# Altium project Archim2.PrjPcb (part 3 of 3)

## Sheet USB.SchDoc: USB
size Letter; DocumentNumber: 2; SheetNumber: 3; SheetTotal: 11
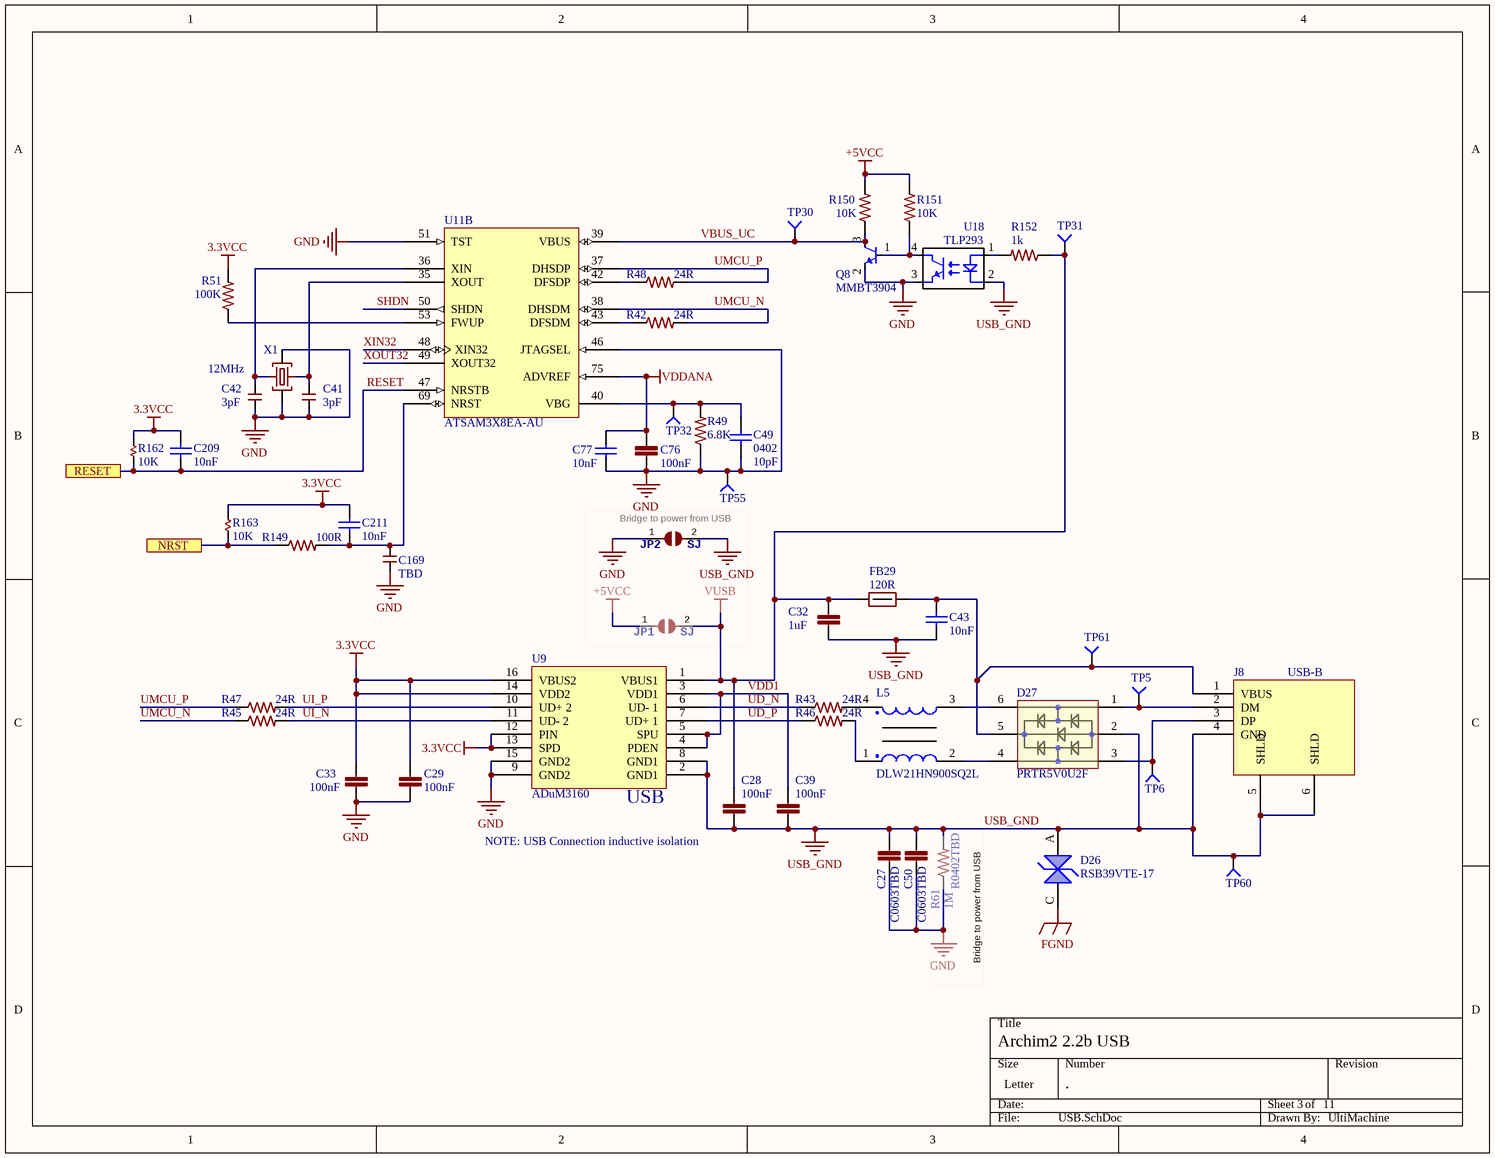
[diagram p10: USB.SchDoc]

### Parts
(Parts that share a designator on the sheet are numbered #1, #2 ... from top to bottom, then left to right.)
C27  C0603TBD  [C0603]
C28  100nF  [C0402]
C29  100nF  [C0402]
C32  1uF  [C0402]
C33  100nF  [C0402]
C39  100nF  [C0402]
C41  3pF  [C0603]
C42  3pF  [C0603]
C43  10nF  [C0402]
C49  0402  value 10pF  [C0402]
C50  C0603TBD  [C0603]
C76  100nF  [C0402]
C77  10nF  [C0402]
C169  TBD  [C0402]
C209  10nF  [C0402]
C211  10nF  [C0402]
D26  RSB39VTE-17  [SOD323-R]
D27  PRTR5V0U2F  [SOT886]
FB29  120R  [FB0603]
J8  USB-B  [PN61729]
JP1  SJ  [SJ]  (no BOM)
JP2  SJ  [SJ]  (no BOM)
L5  DLW21HN900SQ2L  [DLW21HN900SQ2L]
Q8  MMBT3904  [SOT523 SMALL]
R42  24R  [R0402]
R43  24R  [R0402]
R45  24R  [R0402]
R46  24R  [R0402]
R47  24R  [R0402]
R48  24R  [R0402]
R49  6.8K  [R0402]
R51  100K  [R0402]
R61  R0402TBD  value 1M  [R0402TBD]
R149  100R  [R0402]
R150  10K  [R0402]
R151  10K  [R0402]
R152  1k  [R0402]
R162  10K  [R0402]
R163  10K  [R0402]
TP5  TP4  [TP-2]  (value not drawn)  (no BOM)
TP6  TP4  [TP-2]  (value not drawn)  (no BOM)
TP30  TP4  [TP-2]  (value not drawn)  (no BOM)
TP31  TP4  [TP-2]  (value not drawn)  (no BOM)
TP32  TP4  [TP-2]  (value not drawn)  (no BOM)
TP55  TP4  [TP-2]  (value not drawn)  (no BOM)
TP60  TP4  [TP-2]  (value not drawn)  (no BOM)
TP61  TP4  [TP-2]  (value not drawn)  (no BOM)
U9  ADuM3160  [ADuM4160]
U11#2  ATSAM3X8EA-AU  [LQFP144_N]  (part B of 3)
U18  TLP293  [SO-4]
X1  12MHz  [CRYS320500]

### Blocks framed on the sheet
Bridge to power from USB: JP1 JP2

### Ports
NRST, RESET

### Nets
3.3VCC: C29.1 C33.1 C209.1 C211.1 R51.2 R162.2 R163.2 U9.12(PIN) U9.13(SPD) U9.14(VDD2) U9.16(VBUS2)
+5VCC: JP1.1 R150.2 R151.2
FGND: D26.C
GND: C27.2 C29.2 C33.2 C41.1 C42.1 C49.2 C50.2 C76.2 C77.2 C169.2 JP2.1 Q8.2(E) R49.1 R61.1 TP55.1 U9.9(GND2) U9.15(GND2) U11#2.46(JTAGSEL) U11#2.51(TST) U18.3(E) X1.2(GND) X1.4(GND)
USB_GND: C27.1 C28.2 C32.2 C39.2 C43.1 C50.1 D26.A D27.2 J8.4(GND) J8.5(SHLD) J8.6(SHLD) JP2.2 R61.2 TP60.1 U9.2(GND1) U9.8(GND1) U18.2(K)
VDDANA: C76.1 C77.1 U11#2.75(ADVREF)
VUSB: C28.1 C32.1 FB29.1 JP1.2 R152.1 TP31.1 U9.1(VBUS1)
NRST: R149.1 R163.1 ; port NRST
RESET: C209.2 R162.1 U11#2.47(NRSTB) ; port RESET
SHDN: U11#2.50(SHDN)
UD_N: R43.1 U9.6(UD-_1)
UD_P: R46.1 U9.7(UD+_1)
UI_N: R45.2 U9.11(UD-_2)
UI_P: R47.2 U9.10(UD+_2)
UMCU_N: R42.2 R45.1 U11#2.38(DHSDM)
UMCU_P: R47.1 R48.2 U11#2.37(DHSDP)
VBUS_UC: Q8.3(C) R150.1 TP30.1 U11#2.39(VBUS)
VDD1: C39.1 U9.3(VDD1) U9.4(PDEN) U9.5(SPU)
XIN32: U11#2.48(XIN32)
XOUT32: U11#2.49(XOUT32)
NetC41_2: C41.2 U11#2.35(XOUT) X1.3(C2)
NetC42_2: C42.2 U11#2.36(XIN) X1.1(C1)
NetC43_2: C43.2 D27.5 FB29.2 J8.1(VBUS) TP61.1
NetC49_1: C49.1 R49.2 TP32.1 U11#2.40(VBG)
NetC169_1: C169.1 C211.2 R149.2 U11#2.69(NRST)
NetD27_1: D27.1 J8.2(DM) TP5.1
NetD27_3: D27.3 J8.3(DP) TP6.1
NetD27_4: D27.4 L5.2
NetD27_6: D27.6 L5.3
NetL5_1: L5.1 R46.2
NetL5_4: L5.4 R43.2
NetQ8_1: Q8.1(B) R151.1 U18.4(C)
NetR42_1: R42.1 U11#2.43(DFSDM)
NetR48_1: R48.1 U11#2.42(DFSDP)
NetR51_1: R51.1 U11#2.53(FWUP)
NetR152_2: R152.2 U18.1(A)

### Notes on the sheet
- (near U9) USB
- (near C28) NOTE: USB Connection inductive isolation
- (near R61) Bridge to power from USB

### Library data of the parts
C27 C50 = C0603TBD: Capacitor Non Polarized; MANUFACTURER #: DNI-C0603TBD; VALUE: C0603TBD; DNI: DNI
C28 C29 C33 C39 C76 = GRM155R71C104KA88D: CAP CER 0402 100nF 16V 10% X7R; MANUFACTURER: Murata; PART: 0.1uF 16V X7R 0402; PART DESCRIPTION: 0.10µF ±10% 16V Ceramic Capacitor X7R 0402 (1005 Metric); EE_SPEC: 100nF 16V X7R 0402; VALUE: 100nF; MANUFACTURER #: GRM155R71C104KA88D; DISTRIBUTOR #: 490-3261-2-ND; DISTRIBUTOR: Digi-Key Electronics; TOLERANCE: 10%
C32 = GRM155R60J105KE19D: CAP CER 0402 1uF 6.3V 10% X5R; MANUFACTURER: Murata; PART: 1uF 6.3V X5R 0402; PART DESCRIPTION: 1µF ±10% 6.3V Ceramic Capacitor X5R 0402 (1005 Metric); VALUE: 1uF; MANUFACTURER #: GRM155R60J105KE19D; DISTRIBUTOR #: 490-1320-2-ND; DISTRIBUTOR: Digi-Key Electronics; TOLERANCE: 10%; EE_SPEC: 1uF 6.3V X5R 0402
C41 C42 = 3pF 0603 50V NP0: CAP CER 3PF 50V NP0 0603; MANUFACTURER: Samsung; MANUFACTURER #: CL10C030BB8NNNC; PART DESCRIPTION: 3pF ±0.1pF 50V Ceramic Capacitor C0G, NP0 0603 (1608 Metric); TOLERANCE: +/- 0.1pF; DISTRIBUTOR #: 1276-2125-2-ND; DISTRIBUTOR: Digi-Key Electronics; PART: 3pF 50V NP0 0603; EE_SPEC: 50V; VALUE: 3pF
C43 C77 C209 C211 = GRM155R71H103JA88D: CAP CER 10nF 50V X7R 0402; PART DESCRIPTION: 10000pF ±5% 50V Ceramic Capacitor X7R 0402 (1005 Metric); MANUFACTURER: Murata; TOLERANCE: 5%; EE_SPEC: 50V; VALUE: 10nF; MANUFACTURER #: GRM155R71H103JA88D; DISTRIBUTOR #: 490-7763-1-ND; DISTRIBUTOR: Digi-Key Electronics; PART: 10nF 50V X7R 0402
C49 = CL05C100JB5NNNC: CAP CER 10PF 50V 5% NP0 0402; PART DESCRIPTION: 10pF ±5% 50V Ceramic Capacitor C0G, NP0 0402 (1005 Metric); MANUFACTURER: Samsung; PART: 10pF 50V NP0 0402; TOLERANCE: 5%; EE_SPEC: 50V; MANUFACTURER #: CL05C100JB5NNNC; DISTRIBUTOR #: 1276-1139-2-ND; DISTRIBUTOR: Digi-Key Electronics
C169 = C0402_TBD: CAP CER 0402 TBD; MANUFACTURER: TBD; VALUE: TBD; MANUFACTURER #: TBD; DISTRIBUTOR #: TBD; PART: TBD; PART DESCRIPTION: TBD; EE_SPEC: TBD
D26 = RSB39VTE-17: DIODE TVS; MANUFACTURER: Rohm; PART: TVS DIODE 30VWM SOD323; TOLERANCE: -NA-; VALUE: 30V; EE_SPEC: 30Vso 30pF; MANUFACTURER #: RSB39VTE-17; DISTRIBUTOR #: RSB39VTE-17TR-ND; DISTRIBUTOR: Digi-Key Electronics; PART DESCRIPTION: TVS DIODE 30VWM SOD323
D27 = PRTR5V0U2F: Rail-to-rail ESD protection devices; MANUFACTURER #: PRTR5V0U2F,115; MANUFACTURER: NXP; PART: TVS Array, 2 Lines, Low Capacitance; PART DESCRIPTION: TVS DIODE 5.5VWM SOT886; TOLERANCE: -NA-; VALUE: 5.5V; EE_SPEC: 5.5Vso 1pF; DISTRIBUTOR #: 568-4677-2-ND; DISTRIBUTOR: Digi-Key Electronics
FB29 = FERRITE 120R 3A 0603: as FB5-FB8 on sheet Motor-Z; DISTRIBUTOR #: 1276-6351-2-ND; DISTRIBUTOR: Digi-Key Electronics; PART: FERRITE 120R 3A 0603; PART DESCRIPTION: FERRITE BEAD 120 OHM 0603 1LN
J8 = USB-B: MANUFACTURER #: 61729-0010BLF; MANUFACTURER: Amphenol FCI; PART: CONN RCPT USB TYPE B R/A PCB; PART DESCRIPTION: USB - B USB 2.0 Receptacle Connector 4 Position Through Hole, Right Angle; TOLERANCE: -NA-; VALUE: USB B; DISTRIBUTOR #: 609-1039-ND; DISTRIBUTOR: Digi-Key Electronics; EE_SPEC: -NA-
JP1 JP2 = SJ: SMD solder jumper; MANUFACTURER #: NOTAPART-Solder Bridge
L5 = DLW21HN900SQ2L: Common Mode Chokes Dual 90Ohm 100MHz 330mA 350mOhm DCR SMD; MANUFACTURER: Murata; PART: Choke Common-Mode 2LN 90 OHM SMD; PART DESCRIPTION: 2 Line Common Mode Choke Surface Mount 90 Ohm @ 100MHz 330mA DCR 350 mOhm; TOLERANCE: -NA-; VALUE: 90R; EE_SPEC: 50V 330mA 0.33Ohm; MANUFACTURER #: DLW21HN900SQ2L; DISTRIBUTOR #: 490-1064-2-ND; DISTRIBUTOR: Digi-Key Electronics
Q8 = MMBT3904_SOT523: TRANS NPN 60V 0.2A SOT523; MANUFACTURER #: MMBT3904T-7-F; MANUFACTURER: Diodes Incorporated; PART: TRANS NPN 40V 0.2A SOT523; PART DESCRIPTION: Bipolar (BJT) Transistor NPN 40V 200mA 300MHz 150mW Surface Mount SOT-523; TOLERANCE: -NA-; EE_SPEC: 40V 0.2A; DISTRIBUTOR #: MMBT3904T-FDITR-ND; DISTRIBUTOR: Digi-Key Electronics; VALUE: NPN
R42 R43 R45-R48 = CRCW040224R0FKED: Res Thick Film 0402 24 Ohm 1% 0.063W; MANUFACTURER: Yageo; MANUFACTURER #: RC0402FR-0724RL; PART: 24R 1% 0402; PART DESCRIPTION: 24 Ohm ±1% 0.063W, 1/16W Chip Resistor 0402 (1005 Metric) Moisture Resistant Thick Film; EE_SPEC: 1/16W; VALUE: 24R; DISTRIBUTOR #: YAG3073TR-ND; DISTRIBUTOR: Digi-Key Electronics; TOLERANCE: 1%
R49 = CRCW04026K80FKED: RES SMD 6.8K OHM 1% 1/16W 0402; MANUFACTURER: Vishay Dale; PART: 6.8k 1% 0402; PART DESCRIPTION: 6.8k Ohm ±1% 0.063W, 1/16W Chip Resistor 0402 (1005 Metric) Automotive AEC-Q200 Thick Film; VALUE: 6.8K; MANUFACTURER #: CRCW04026K80FKED; DISTRIBUTOR #: 541-6.80KLTR-ND; DISTRIBUTOR: Digi-Key Electronics; TOLERANCE: 1%; EE_SPEC: 1/16W
R51 = RC1005F104CS: RES SMD 100K OHM 1% 1/16W 0402; MANUFACTURER: Samsung; PART: 100k 1% 0402; PART DESCRIPTION: 100k Ohm ±1% 0.063W, 1/16W Chip Resistor 0402 (1005 Metric) Moisture Resistant Thick Film; VALUE: 100K; MANUFACTURER #: RC1005F104CS; DISTRIBUTOR #: 1276-3432-1-ND; DISTRIBUTOR: Digi-Key Electronics; TOLERANCE: 1%; EE_SPEC: 1/16W
R61 = ERJ2GEJ105X: RES 0402 1M 100mW 5%; MANUFACTURER: Panasonic; PART: 1M 5% 0402; PART DESCRIPTION: 1M Ohm ±5% 0.1W, 1/10W Chip Resistor 0402 (1005 Metric) Automotive AEC-Q200 Thick Film; EE_SPEC: 1/10W; MANUFACTURER #: ERJ2GEJ105X; DISTRIBUTOR #: P1.0MJTR-ND; DISTRIBUTOR: Digi-Key Electronics; TOLERANCE: 5%; DNI: DNI
R149 = RES 100R 0402 1%: RES SMD 100 OHM 1% 1/16W 0402; MANUFACTURER: Yageo; MANUFACTURER #: RC0402FR-07100RL; PART: 100R 1% 0402; PART DESCRIPTION: 100 Ohm ±1% 0.063W, 1/16W Chip Resistor 0402 (1005 Metric) Moisture Resistant Thick Film; VALUE: 100R; DISTRIBUTOR #: 311-100LRTR-ND; DISTRIBUTOR: Digi-Key Electronics; TOLERANCE: 1%; EE_SPEC: 1/16W
R150 R151 = RC0402FR-0710KP: RES SMD 10K OHM 1% 1/16W 0402; MANUFACTURER: Yageo; PART: 10k 1% 0402; PART DESCRIPTION: 10k Ohm ±1% 0.063W, 1/16W Chip Resistor 0402 (1005 Metric) Moisture Resistant Thick Film; VALUE: 10K; MANUFACTURER #: RC0402FR-0710KP; DISTRIBUTOR #: YAG1249TR-ND; DISTRIBUTOR: Digi-Key Electronics; TOLERANCE: 1%; EE_SPEC: 1/16W
R152 = RK73H1ETTP1001F: RES 0402 1k 63mW 1%; MANUFACTURER: Yageo; MANUFACTURER #: RC0402FR-071KL; PART: 1k 1% 0402; PART DESCRIPTION: 1k Ohm ±1% 0.063W, 1/16W Chip Resistor 0402 (1005 Metric) Moisture Resistant Thick Film; EE_SPEC: 1/16W; VALUE: 1k; DISTRIBUTOR #: 311-1.00KLRTR-ND; DISTRIBUTOR: Digi-Key Electronics; TOLERANCE: 1%
R162 R163 = 10k 1% 0402: RES SMD 10K OHM 1% 1/16W 0402; MANUFACTURER: Yageo; MANUFACTURER #: RC0402FR-0710KP; PART DESCRIPTION: 10k Ohm ±1% 0.063W, 1/16W Chip Resistor 0402 (1005 Metric) Moisture Resistant Thick Film; DISTRIBUTOR #: YAG1249TR-ND; DISTRIBUTOR: Digikey; PART: 10k 1% 0402; TOLERANCE: 1%; EE_SPEC: 1/16W; VALUE: 10K
TP5 TP6 TP30-TP32 TP55 TP60 TP61 = Socket: MANUFACTURER #: NOTAPART-Testpoint
U9 = ADuM4160: USB Opto Isolator; MANUFACTURER #: ADUM3160BRWZ-RL; MANUFACTURER: Analog Devices; PART: IC DGTL ISO 2.5KV 2CH USB 16SOIC; PART DESCRIPTION: USB Digital Isolator 2500Vrms 2 Channel 12Mbps 25kV/µs CMTI 16-SOIC (0.295", 7.50mm Width); TOLERANCE: -NA-; VALUE: USB ISO; EE_SPEC: 2500V ISO; DISTRIBUTOR #: ADUM3160BRWZ-RLTR-ND; DISTRIBUTOR: Digi-Key Electronics
U11#2 = ATML-ATSAM3X-LQFP-144: Atmel; PART: IC MCU 32BIT 512KB FLASH 144LQFP; PART DESCRIPTION: ARM® Cortex®-M3 SAM3X Microcontroller IC 32-Bit 84MHz 512KB (512K x 8) FLASH 144-LQFP (20x20); TOLERANCE: -NA-; VALUE: -NA-; EE_SPEC: 3.3V; MANUFACTURER #: ATSAM3X8EA-AU; MANUFACTURER: Atmel; DISTRIBUTOR #: ATSAM3X8EA-AU-ND; DISTRIBUTOR: Digi-Key Electronics
U18 = OPTO SO-4 OPNDRN OUT: Optoisolator Transistor Output 3750Vrms 1 Channel 4-SO; MANUFACTURER #: TLP293(TPL,E; MANUFACTURER: TOSHIBA; PART: Opto-Isolator 3.75kV; TOLERANCE: -NA-; VALUE: -NA-; EE_SPEC: 3.75kV Isolation; DISTRIBUTOR #: TLP293(TPLETR-ND; DISTRIBUTOR: Digi-Key Electronics; PART DESCRIPTION: Optoisolator Transistor Output 3750Vrms 1 Channel 4-SO
X1 = 405C35B12M00000: Crystal 12MHz ±30ppm (Tol) ±50ppm (Stability) 13pF FUND 50Ohm; MANUFACTURER: CTS; PART: 12MHz XTAL; PART DESCRIPTION: 12MHz ±30ppm Crystal 13pF 60 Ohm -20°C ~ 70°C Surface Mount 4-SMD, No Lead (DFN, LCC); TOLERANCE: +/- 30ppm; EE_SPEC: -NA-; MANUFACTURER #: 405C35B12M00000; DISTRIBUTOR #: CTX639TR-ND; DISTRIBUTOR: Digi-Key Electronics; VALUE: 12MHz

## Nets that join several sheets
3.3VCC: EndStops (18 pins), Microcontroller (32 pins), Motor-E1 (C85.1 R60.2 U13.8), Motor-E2 (C109.1 R104.2 U14.8), Motor-X (C123.1 R112.2 U15.8), Motor-Y (C174.1 R123.2 U16.8), Motor-Z (C187.1 R130.2 U17.8), Power (C24.1 R33.2 TP47.1 U8.4), Thermistors (8 pins), USB (11 pins)
5V-MOT: Motor-E1 (5 pins), Motor-E2 (5 pins), Motor-X (5 pins), Motor-Y (5 pins), Motor-Z (5 pins), Power (FB22.2 TP3.TP)
+5VCC: Microcontroller (8 pins), Mosfets (14 pins), Power (11 pins), USB (JP1.1 R150.2 R151.2)
FGND: Microcontroller (12 pins), Mosfets (D21.A), Power (17 pins), USB (D26.C)
GND: EndStops (30 pins), Microcontroller (58 pins), Mosfets (43 pins), Motor-E1 (34 pins), Motor-E2 (34 pins), Motor-X (34 pins), Motor-Y (34 pins), Motor-Z (34 pins), Power (67 pins), Thermistors (16 pins), USB (22 pins)
VBED: Mosfets (C11.1 D15.C J1.10 R9.2), Power (6 pins)
VDDANA: Microcontroller (5 pins), USB (C76.1 C77.1 U11#2.75)
VMOT: Motor-E1 (FB21.2), Motor-E2 (FB23.2), Motor-X (FB24.2), Motor-Y (FB25.2), Motor-Z (FB31.2), Power (9 pins)
VPWR: Mosfets (20 pins), Power (21 pins)
E1-DIR: Microcontroller (U11#1.117), Motor-E1 (U13.7)
E1-EN: Microcontroller (U11#1.141), Motor-E1 (U13.22)
E1-STEP: Microcontroller (U11#1.128), Motor-E1 (U13.6)
E1_DIAG: Microcontroller (U11#1.142), Motor-E1 (R60.1 U13.20 U13.21)
E1_nCS: Microcontroller (U11#1.131), Motor-E1 (U13.2)
E2-DIR: Microcontroller (U11#1.143), Motor-E2 (U14.7)
E2-EN: Microcontroller (U11#1.4), Motor-E2 (U14.22)
E2-STEP: Microcontroller (U11#1.1), Motor-E2 (U14.6)
E2_DIAG: Microcontroller (U11#1.13), Motor-E2 (R104.1 U14.20 U14.21)
E2_nCS: Microcontroller (U11#1.3), Motor-E2 (U14.2)
Fan1: Microcontroller (U11#1.137), Mosfets (R26.2 U2.2)
Fan2: Microcontroller (U11#1.136), Mosfets (R28.2 U6.2)
Heat1: Microcontroller (U11#1.135), Mosfets (R54.2 U10.2)
Heat2: Microcontroller (U11#1.134), Mosfets (R39.2 U10.5)
Heat3: Microcontroller (U11#1.133), Mosfets (R29.2 U10.12)
HeatBed: Microcontroller (U11#1.132), Mosfets (R30.2 U10.9)
MAX_ES1: EndStops (C86.1 D13.K R23.1 R35.1), Microcontroller (U11#1.32)
MAX_ES2: EndStops (C158.1 D33.K R73.1 R74.1), Microcontroller (U11#1.18)
MAX_ES3: EndStops (C160.1 D35.K R78.1 R79.1), Microcontroller (U11#1.22)
MIN_ES1: EndStops (C84.1 D3.K R19.1 R22.1), Microcontroller (U11#1.17)
MIN_ES2: EndStops (C157.1 D32.K R63.1 R72.1), Microcontroller (U11#1.19)
MIN_ES3: EndStops (C159.1 D34.K R75.1 R76.1), Microcontroller (U11#1.26)
MISO: Microcontroller (U11#1.14), Motor-E1 (U13.5), Motor-E2 (U14.5), Motor-X (U15.5), Motor-Y (U16.5), Motor-Z (U17.5)
MOSI: Microcontroller (U11#1.16), Motor-E1 (U13.4), Motor-E2 (U14.4), Motor-X (U15.4), Motor-Y (U16.4), Motor-Z (U17.4)
NRST: Microcontroller (D71.C J20.18 J28.6 R145.2), USB (R149.1 R163.1)
REF-E1: Microcontroller (R99.1), Motor-E1 (R56.1)
REF-E2: Microcontroller (R97.2), Motor-E2 (R88.1)
REF_Z: Microcontroller (R101.1), Motor-Z (R126.1)
RESET: Microcontroller (C40.1 J4.10 S1.1 TP56.1), USB (C209.2 R162.1 U11#2.47)
SCK: Microcontroller (U11#1.15), Motor-E1 (U13.3), Motor-E2 (U14.3), Motor-X (U15.3), Motor-Y (U16.3), Motor-Z (U17.3)
THERM_AN1: Microcontroller (U11#1.90), Thermistors (C103.1 R44.1 TP101.1)
THERM_AN2: Microcontroller (U11#1.89), Thermistors (C161.1 R81.1 TP9.1)
THERM_AN3: Microcontroller (U11#1.91), Thermistors (C162.1 R91.1 TP10.1)
THERM_AN4: Microcontroller (U11#1.88), Thermistors (C163.1 R94.1 TP12.1)
X-DIR: Microcontroller (U11#1.63), Motor-X (U15.7)
X-EN: Microcontroller (U11#1.67), Motor-X (U15.22)
X-REF: Microcontroller (R96.1), Motor-X (R107.1)
X-STEP: Microcontroller (U11#1.64), Motor-X (U15.6)
X_DIAG: Microcontroller (U11#1.83), Motor-X (R112.1 U15.20 U15.21)
X_nCS: Microcontroller (U11#1.65), Motor-X (U15.2)
Y-DIR: Microcontroller (U11#1.93), Motor-Y (U16.7)
Y-EN: Microcontroller (U11#1.96), Motor-Y (U16.22)
Y-REF: Microcontroller (R98.2), Motor-Y (R117.1)
Y-STEP: Microcontroller (U11#1.94), Motor-Y (U16.6)
Y_DIAG: Microcontroller (U11#1.97), Motor-Y (R123.1 U16.20 U16.21)
Y_nCS: Microcontroller (U11#1.95), Motor-Y (U16.2)
Z-DIR: Microcontroller (U11#1.98), Motor-Z (U17.7)
Z-EN: Microcontroller (U11#1.101), Motor-Z (U17.22)
Z-STEP: Microcontroller (U11#1.99), Motor-Z (U17.6)
Z_DIAG: Microcontroller (U11#1.116), Motor-Z (R130.1 U17.20 U17.21)
Z_nCS: Microcontroller (U11#1.100), Motor-Z (U17.2)